# Altium project lm1117-5.PrjPCB
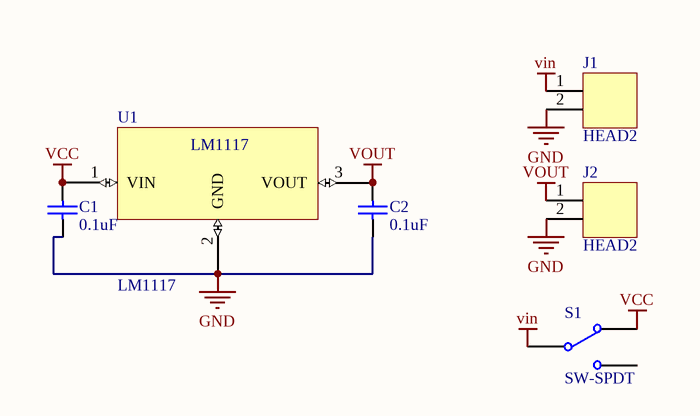
[diagram p0: lm1117-5.SchDoc]
1 sheet, 6 parts. Net scope: global (net labels, ports and power ports of the same name join across sheets).
Board file: lm1117-5.PcbDoc

## Sheet lm1117-5.SchDoc
size A4

### Parts
C1  value 0.1uF  [CC1005-0402]  (hidden comment: CAP)
C2  value 0.1uF  [CC1005-0402]  (hidden comment: CAP)
J1  HEAD2  [HEAD2M]
J2  HEAD2  [HEAD2M]
S1  SW-SPDT  [SPDT-3Z]
U1  LM1117  [DSO-G3/P2.3]

### Nets
GND: C1.1 C2.1 J1.2 J2.2 U1.2(GND)
VCC: C1.2 S1.1(NC) U1.1(VIN)
vin: J1.1 S1.2(COMMON)
VOUT: C2.2 J2.1 U1.3(VOUT)

Not connected (* = marked no-connect by the designer): S1 3(NO)

### Library data of the parts
C1 C2 = CAP: Capacitor; Manufacturer: Generic Components; Class: Passive; Published: 08/06/2000; Publisher: Altium Hobart Technology Centre; SubClass: Capacitor
J1 J2 = HEAD2: Connector,2-pin; Class: Connector
S1 = SW-SPDT: Single-Pole, Double-Throw Switch; Manufacturer: Generic Components; Published: 1999